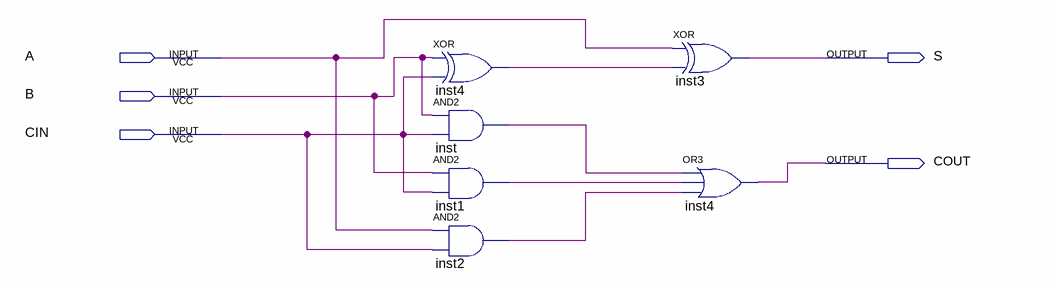
[diagram p0: schematic sheet]
// Quartus schematic FullAdderEsquematico.bdf as structural Verilog: 6 symbols, 5 pins
module FullAdderEsquematico (
  input  A,
  input  B,
  input  CIN,
  output S,
  output COUT
);

  wire inst1_out, inst2_out, inst4_out, inst_out;

  xor inst4 (inst4_out, B, CIN);
  and inst (inst_out, B, CIN);
  and inst1 (inst1_out, B, CIN);
  and inst2 (inst2_out, A, CIN);
  xor inst3 (S, A, inst4_out);
  or inst4_dup2 (COUT, inst_out, inst1_out, inst2_out);
endmodule
